# EAGLE design pxvi-001 (EAGLE 9.6.2)
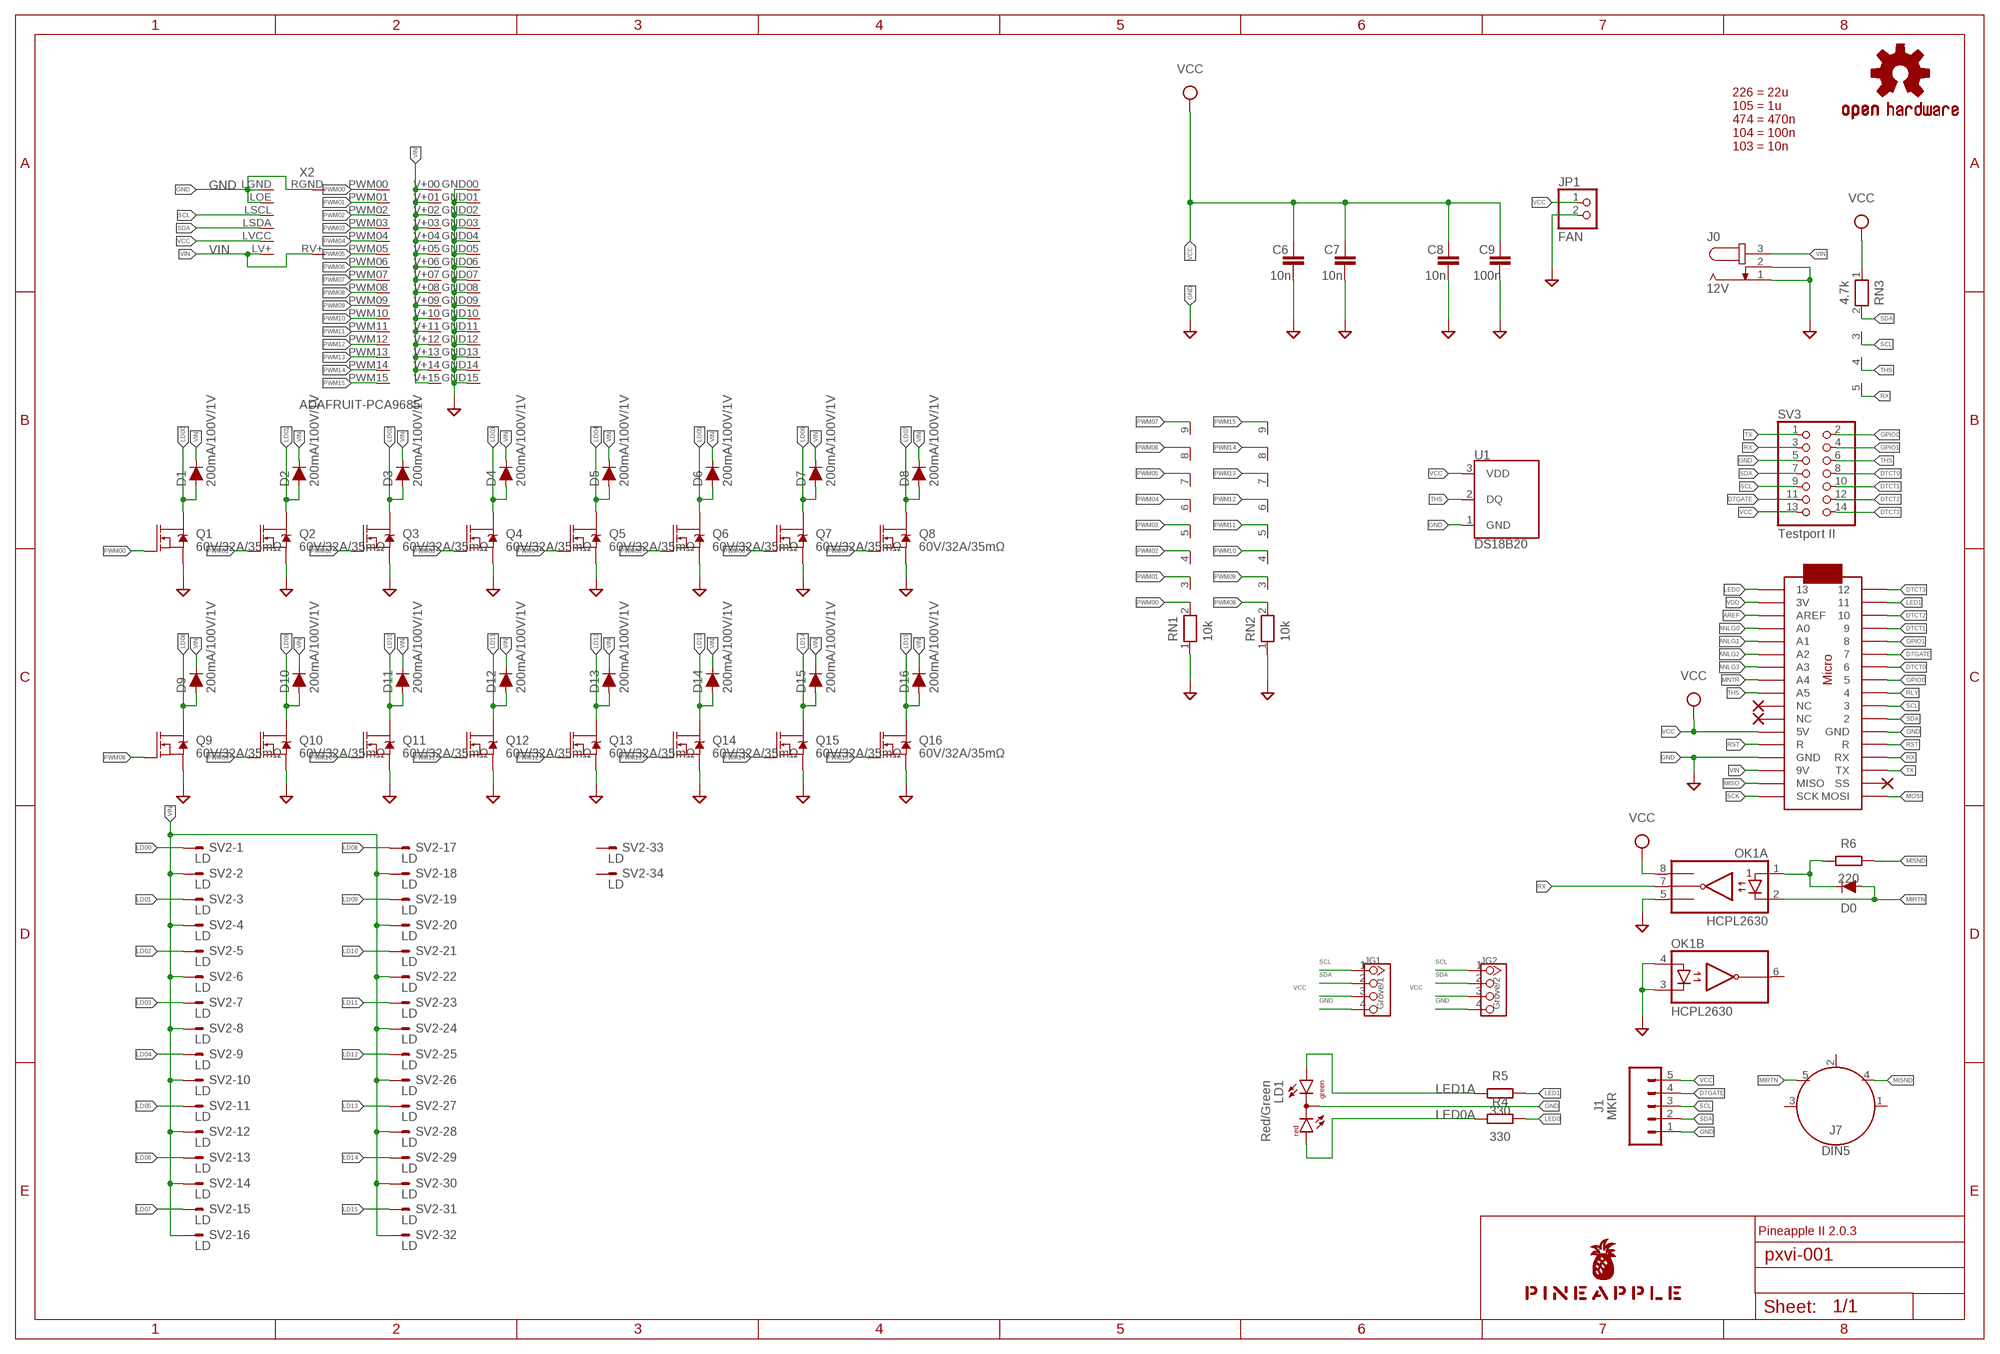
[diagram p0: schematic, sheet 1]

## Parts
C6  10n  C-EU025-024X044  [C025-024X044]
C7  10n  C-EU025-024X044  [C025-024X044]
C8  10n  C-EU025-024X044  [C025-024X044]
C9  100n  C-EU025-024X044  [C025-024X044]
D0  DIODE-1N4148  [DIODE-1N4148]
D1  200mA/100V/1V  DIODE-1N4148  [DIODE-1N4148]
D2  200mA/100V/1V  DIODE-1N4148  [DIODE-1N4148]
D3  200mA/100V/1V  DIODE-1N4148  [DIODE-1N4148]
D4  200mA/100V/1V  DIODE-1N4148  [DIODE-1N4148]
D5  200mA/100V/1V  DIODE-1N4148  [DIODE-1N4148]
D6  200mA/100V/1V  DIODE-1N4148  [DIODE-1N4148]
D7  200mA/100V/1V  DIODE-1N4148  [DIODE-1N4148]
D8  200mA/100V/1V  DIODE-1N4148  [DIODE-1N4148]
D9  200mA/100V/1V  DIODE-1N4148  [DIODE-1N4148]
D10  200mA/100V/1V  DIODE-1N4148  [DIODE-1N4148]
D11  200mA/100V/1V  DIODE-1N4148  [DIODE-1N4148]
D12  200mA/100V/1V  DIODE-1N4148  [DIODE-1N4148]
D13  200mA/100V/1V  DIODE-1N4148  [DIODE-1N4148]
D14  200mA/100V/1V  DIODE-1N4148  [DIODE-1N4148]
D15  200mA/100V/1V  DIODE-1N4148  [DIODE-1N4148]
D16  200mA/100V/1V  DIODE-1N4148  [DIODE-1N4148]
J0  12V  JACK-PLUG0  [SPC4077]
J1  MKR  CONN_05JST  [JST-5-PTH]
J7  DIN5  [DIN5-RA-PTH]
JG1  Grove/1  TWIG-4P-2.0'90D'  [4P-2.0-90D]
JG2  Grove/2  TWIG-4P-2.0'90D'  [4P-2.0-90D]
JP1  FAN  PINHD-1X2  [1X02]
LD1  Red/Green  DUOLED-RG-C  [DUOLED-C-5MM]
LOGO1  OSHW-LOGOS-COPPER  [OSHW-LOGO-S_COPPER]
MC1  ARDUINOMICRO  [ARDUINOMICRO]
OK1  HCPL2630  [DIL08]
Q1  60V/32A/35mΩ  MOSFET-NCH-FQP30N06L  [TO220V]
Q2  60V/32A/35mΩ  MOSFET-NCH-FQP30N06L  [TO220V]
Q3  60V/32A/35mΩ  MOSFET-NCH-FQP30N06L  [TO220V]
Q4  60V/32A/35mΩ  MOSFET-NCH-FQP30N06L  [TO220V]
Q5  60V/32A/35mΩ  MOSFET-NCH-FQP30N06L  [TO220V]
Q6  60V/32A/35mΩ  MOSFET-NCH-FQP30N06L  [TO220V]
Q7  60V/32A/35mΩ  MOSFET-NCH-FQP30N06L  [TO220V]
Q8  60V/32A/35mΩ  MOSFET-NCH-FQP30N06L  [TO220V]
Q9  60V/32A/35mΩ  MOSFET-NCH-FQP30N06L  [TO220V]
Q10  60V/32A/35mΩ  MOSFET-NCH-FQP30N06L  [TO220V]
Q11  60V/32A/35mΩ  MOSFET-NCH-FQP30N06L  [TO220V]
Q12  60V/32A/35mΩ  MOSFET-NCH-FQP30N06L  [TO220V]
Q13  60V/32A/35mΩ  MOSFET-NCH-FQP30N06L  [TO220V]
Q14  60V/32A/35mΩ  MOSFET-NCH-FQP30N06L  [TO220V]
Q15  60V/32A/35mΩ  MOSFET-NCH-FQP30N06L  [TO220V]
Q16  60V/32A/35mΩ  MOSFET-NCH-FQP30N06L  [TO220V]
R4  330  R-EU_0204/5  [0204/5]
R5  330  R-EU_0204/5  [0204/5]
R6  220  R-EU_0204/5  [0204/5]
RN1  10k  RN08  [RN-9]
RN2  10k  RN08  [RN-9]
RN3  4.7k  RN04  [RN-5]
SV2  LD  ML34LE  [ML34L]
SV3  Testport II  PINHD-2X7  [2X07]
U1  DS18B20  [TO-92-AMMO]
U$1  PINEAPPLE450_SILK  [PINEAPPLE450_SILK]
X2  ADAFRUIT-PCA9685  [ADAFRUIT-PCA9685-FOOTPRINT]

## Nets
ANLG0 [analog]: MC1.P$31(A0)
ANLG1 [analog]: MC1.P$30(A1)
ANLG2 [analog]: MC1.P$29(A2)
ANLG3 [analog]: MC1.P$28(A3)
AREF: MC1.P$32(AREF)
D7GATE: J1.4 MC1.P$6 SV3.11
DTCT0: MC1.P$7 SV3.8
DTCT1: MC1.P$4 SV3.10
DTCT2: MC1.P$3 SV3.12
DTCT3: MC1.P$1 SV3.14
GND [gnd]: C6.2 C7.2 C8.2 C9.2 J0.1 J0.2 J1.1 JG1.4 JG2.4 JP1.2 LD1.C MC1.P$12(GND) MC1.P$21(GND) OK1.3(B:C2) OK1.4(B:A2) OK1.5(A:GND) Q1.3(S) Q2.3(S) Q3.3(S) Q4.3(S) Q5.3(S) Q6.3(S) Q7.3(S) Q8.3(S) Q9.3(S) Q10.3(S) Q11.3(S) Q12.3(S) Q13.3(S) Q14.3(S) Q15.3(S) Q16.3(S) RN1.1 RN2.1 SV3.5 U1.1(GND) X2.GND00 X2.GND01 X2.GND02 X2.GND03 X2.GND04 X2.GND05 X2.GND06 X2.GND07 X2.GND08 X2.GND09 X2.GND10 X2.GND11 X2.GND12 X2.GND13 X2.GND14 X2.GND15 X2.LGND X2.LOE X2.RGND
GPIO0: MC1.P$8 SV3.2
GPIO1: MC1.P$5 SV3.4
LD00 [power]: D1.A Q1.2(D) SV2.1
LD01 [power]: D2.A Q2.2(D) SV2.3
LD02 [power]: D3.A Q3.2(D) SV2.5
LD03 [power]: D4.A Q4.2(D) SV2.7
LD04 [power]: D5.A Q5.2(D) SV2.9
LD05 [power]: D6.A Q6.2(D) SV2.11
LD06 [power]: D7.A Q7.2(D) SV2.13
LD07 [power]: D8.A Q8.2(D) SV2.15
LD08 [power]: D9.A Q9.2(D) SV2.17
LD09 [power]: D10.A Q10.2(D) SV2.19
LD10 [power]: D11.A Q11.2(D) SV2.21
LD11 [power]: D12.A Q12.2(D) SV2.23
LD12 [power]: D13.A Q13.2(D) SV2.25
LD13 [power]: D14.A Q14.2(D) SV2.27
LD14 [power]: D15.A Q15.2(D) SV2.29
LD15 [power]: D16.A Q16.2(D) SV2.31
LED0: MC1.P$34 R4.2
LED0A: LD1.AR R4.1
LED1: MC1.P$2 R5.2
LED1A: LD1.AX(AG) R5.1
MIDIINSND: D0.C OK1.1(A:A1) R6.1
MIRTN: D0.A J7.5 OK1.2(A:C1)
MISND: J7.4 R6.2
MISO: MC1.P$19(MISO)
MNTR: MC1.P$27(A4)
MOSI: MC1.P$17(MOSI)
PWM00: Q1.1(G) RN1.2 X2.PWM00
PWM01: Q2.1(G) RN1.3 X2.PWM01
PWM02: Q3.1(G) RN1.4 X2.PWM02
PWM03: Q4.1(G) RN1.5 X2.PWM03
PWM04: Q5.1(G) RN1.6 X2.PWM04
PWM05: Q6.1(G) RN1.7 X2.PWM05
PWM06: Q7.1(G) RN1.8 X2.PWM06
PWM07: Q8.1(G) RN1.9 X2.PWM07
PWM08: Q9.1(G) RN2.2 X2.PWM08
PWM09: Q10.1(G) RN2.3 X2.PWM09
PWM10: Q11.1(G) RN2.4 X2.PWM10
PWM11: Q12.1(G) RN2.5 X2.PWM11
PWM12: Q13.1(G) RN2.6 X2.PWM12
PWM13: Q14.1(G) RN2.7 X2.PWM13
PWM14: Q15.1(G) RN2.8 X2.PWM14
PWM15: Q16.1(G) RN2.9 X2.PWM15
RLY: MC1.P$9
RST: MC1.P$13(R) MC1.P$22(R)
RX: MC1.P$14(RX) OK1.7(A:VO1) RN3.5 SV3.3
SCK: MC1.P$18(SCK)
SCL: J1.3 JG1.1 JG2.1 MC1.P$10 RN3.3 SV3.9 X2.LSCL
SDA: J1.2 JG1.2 JG2.2 MC1.P$11 RN3.2 SV3.7 X2.LSDA
THS: MC1.P$26(A5) RN3.4 SV3.6 U1.2(DQ)
TX: MC1.P$15(TX) SV3.1
VCC [power]: C6.1 C7.1 C8.1 C9.1 J1.5 JG1.3 JG2.3 JP1.1 MC1.P$23(5V) OK1.8(A:VCC) RN3.1 SV3.13 U1.3(VDD) X2.LVCC
VDD [power]: MC1.P$33(3V)
VIN [superpower]: D1.C D2.C D3.C D4.C D5.C D6.C D7.C D8.C D9.C D10.C D11.C D12.C D13.C D14.C D15.C D16.C J0.3 MC1.P$20(9V) SV2.2 SV2.4 SV2.6 SV2.8 SV2.10 SV2.12 SV2.14 SV2.16 SV2.18 SV2.20 SV2.22 SV2.24 SV2.26 SV2.28 SV2.30 SV2.32 X2.LV+ X2.RV+ X2.V+00 X2.V+01 X2.V+02 X2.V+03 X2.V+04 X2.V+05 X2.V+06 X2.V+07 X2.V+08 X2.V+09 X2.V+10 X2.V+11 X2.V+12 X2.V+13 X2.V+14 X2.V+15
Unconnected: J7.1 J7.2 J7.3 MC1.P$16(SS) MC1.P$24(NC) MC1.P$25(NC) OK1.6(B:VO2) SV2.33 SV2.34

## Notes on the sheet
- 226 = 22u
  105 = 1u
  474 = 470n
  104 = 100n
  103 = 10n
- Pineapple II 2.0.3

## Library data of the parts
C6-C9 = resistor:C-EU: CAPACITOR, European symbol
D0 = SparkFun-DiscreteSemi:DIODE: Diode These are standard reverse protection diodes and small signal diodes. SparkFun Products: SparkFun SparkPunk Sound Kit <https://www.sparkfun.com/products/11177> SparkFun ESP8266 Thing <https://www.sparkfun.com/products/13231>; PROD_ID: DIO-08378; VALUE: 200mA/100V/1V
D1-D16 = SparkFun-DiscreteSemi:DIODE: Diode These are standard reverse protection diodes and small signal diodes. SparkFun Products: SparkFun SparkPunk Sound Kit <https://www.sparkfun.com/products/11177> SparkFun ESP8266 Thing <https://www.sparkfun.com/products/13231>; PROD_ID: DIO-08378
J0 = con-jack:JACK-PLUG: DC POWER JACK Power Jack, DC, Right Angle, Through Hole, Rated 5A at 16VDC, PC Terminals Distributor: Farnell (www.Farnell.de) Drawing: 84N1161.pdf / 84N1162.pdf Manufacturer: SPC Technology (www.spctechnology.com) Type: SPC4077 / SPC 4078; OC_FARNELL: unknown; OC_NEWARK: unknown
J1 = SparkFun-Connectors:CONN_05: Multi connection point. Often used as Generic Header-pin footprint for 0.1 inch spaced/style header connections On any of the 0.1 inch spaced packages, you can populate with these: Break Away Headers - Straight <https://www.sparkfun.com/products/116> (PRT-00116) Break Away Male Headers - Right Angle <https://www.sparkfun.com/products/553> (PRT-00553) Female Headers <https://www.sparkfun.com/products/115> (PRT-00115) Break Away Headers - Machine Pin <https://www.sparkfun.com/products/117> (PRT-00117) Break Away Female Headers - Swiss Machine Pin <https://www.sparkfun.com/products/743> (PRT-00743) For SCREWTERMINALS and SPRING TERMINALS visit here: Screw Terimnals on SparkFun.com <https://www.sparkfun.com/search/results?term=Screw+Terminals> (5mm/3.5mm/2.54mm spacing) This device is also useful as a general connection point to wire up your design to another part of your project. Our various solder wires solder well into these plated through hole pads. Hook-Up Wire - Assortment (Stranded, 22 AWG) <https://www.sparkfun.com/products/11375> (PRT-11375) Hook-Up Wire - Assortment (Solid Core, 22 AWG) <https://www.sparkfun.com/products/11367> (PRT-11367) View the entire wire category on our website here <https://www.sparkfun.com/categories/141> Special notes: Molex polarized connector foot print use with SKU : PRT-08231 with associated crimp pins and housings. 1MM SMD Version SKU: PRT-10208; SF_ID: PRT-09917
J7 = SparkFun-Connectors:DIN5: DIN5 Connector - Female Right Angle (frequently used as a MIDI Jack connector) This type of connector and cable is frequently used for transmitting midi data (musical instrument digital interface). It is what you usually see on a keyboard or set of electronic drums. Learn more here <https://en.wikipedia.org/wiki/MIDI>. For more information on the pinout and electrical specifications of MIDI communications, please see the following resource: https://www.midi.org/specifications/item/midi-din-electrical-specification Here is the connector we sell at SparkFun: MIDI Connector - Female Right Angle <https://www.sparkfun.com/products/9536> (PRT-09536) Datasheet <hhttp://www.sparkfun.com/datasheets/Prototyping/Connectors/MIDI-RA.pdf> It is used on this SparkFun product: SparkFun MIDI Shield <https://www.sparkfun.com/products/12898> (DEV-12898); PROD_ID: CONN-09481
JG1 JG2 = Connector:TWIG-4P-2.0
JP1 = pinhead:PINHD-1X2: PIN HEADER
LD1 = led:DUOLED-RG-C: DUO LED 2 colors (red/green), 5 mm, round, common Cathode www.ligitek.com or other producers.
LOGO1 = SparkFun-Aesthetics:OSHW-LOGO: Open-Source Hardware (OSHW) Logo This logo indicates the piece of hardware it is found on incorporates a OSHW license and/or adheres to the definition of open source hardware found here: http://freedomdefined.org/OSHW
MC1 = adafruit:ARDUINOMICRO
OK1 = optocoupler:HCPL2630: HEWLETT PACKARD OPTO COUPLER; MF: AGILENT TECHNOLOGIES; MPN: HCPL-2630-000E; OC_FARNELL: 9994904; OC_NEWARK: 88H7813
Q1-Q16 = SparkFun-DiscreteSemi:MOSFET-NCH: N-channel MOSFETs Voltage controlled devices that allow control of high current outputs. SparkFun Products: SparkFun OpenScale <https://www.sparkfun.com/products/13261> SparkFun Digital Sandbox <https://www.sparkfun.com/products/12651> SparkFun Monster Moto Shield <https://www.sparkfun.com/products/10182> SparkFun MOSFET Power Controller <https://www.sparkfun.com/products/11214>; PROD_ID: TRANS-10060
R4-R6 = resistor:R-EU_: RESISTOR, European symbol
RN1 RN2 = resistor-net:RN08: RESISTOR NETWORK; OC_FARNELL: unknown; OC_NEWARK: unknown
RN3 = resistor-net:RN04: RESISTOR NETWORK; OC_FARNELL: unknown; OC_NEWARK: unknown
SV2 = con-ml:ML34LE: HARTING; OC_FARNELL: unknown; OC_NEWARK: unknown
SV3 = pinhead:PINHD-2X7: PIN HEADER
U1 = SparkFun-Sensors:DS18B20: Dallas/Maxim DS18B20 1-Wire Temperature Sensor The DS18B20 reports degrees C with 9 to 12-bit precision, -55C to 125C (+/-0.5C). Each sensor has a unique 64-Bit Serial number etched into it - allows for a huge number of sensors to be used on one data bus. Datasheet <http://datasheets.maximintegrated.com/en/ds/DS18B20.pdf> SparkFun Products One Wire Digital Temperature Sensor - DS18B20 <https://www.sparkfun.com/products/245> (SEN-00245); STORE_ID: SEN-00245
U$1 = pineapple:PINEAPPLE450_SILK
X2 = adafruit-pca9685:ADAFRUIT-PCA9685: AQM0802A-RN-GBW LCD

## Net classes
0 default: width 0.152 mm, drill 0.152 mm, clearance 0.152 mm
1 gnd: width 0.305 mm, drill 0.152 mm, clearance 0.152 mm
2 power: width 0.508 mm, drill 0.152 mm, clearance 0.152 mm
3 analog: width 0.305 mm, drill 0.152 mm, clearance 0.152 mm
4 superpower: width 1.016 mm, drill 0.152 mm, clearance 0.152 mm

## Board
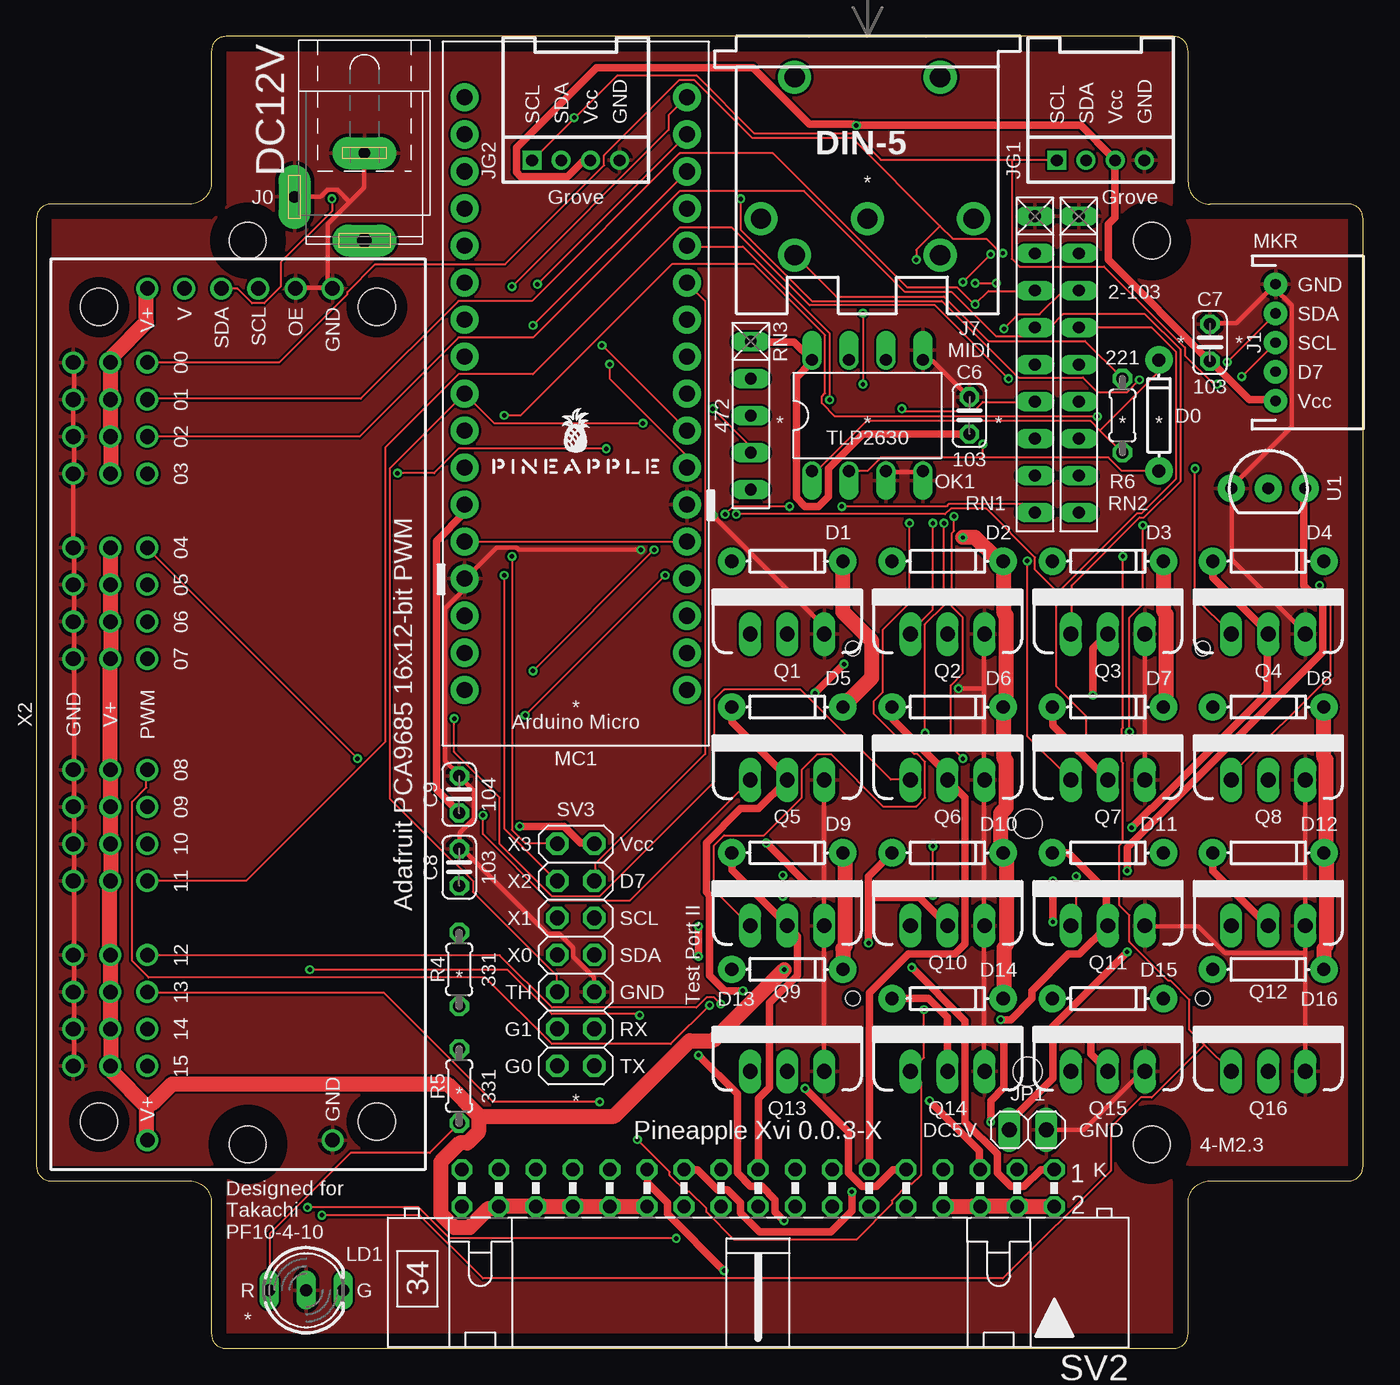
[diagram p1: board, top side]
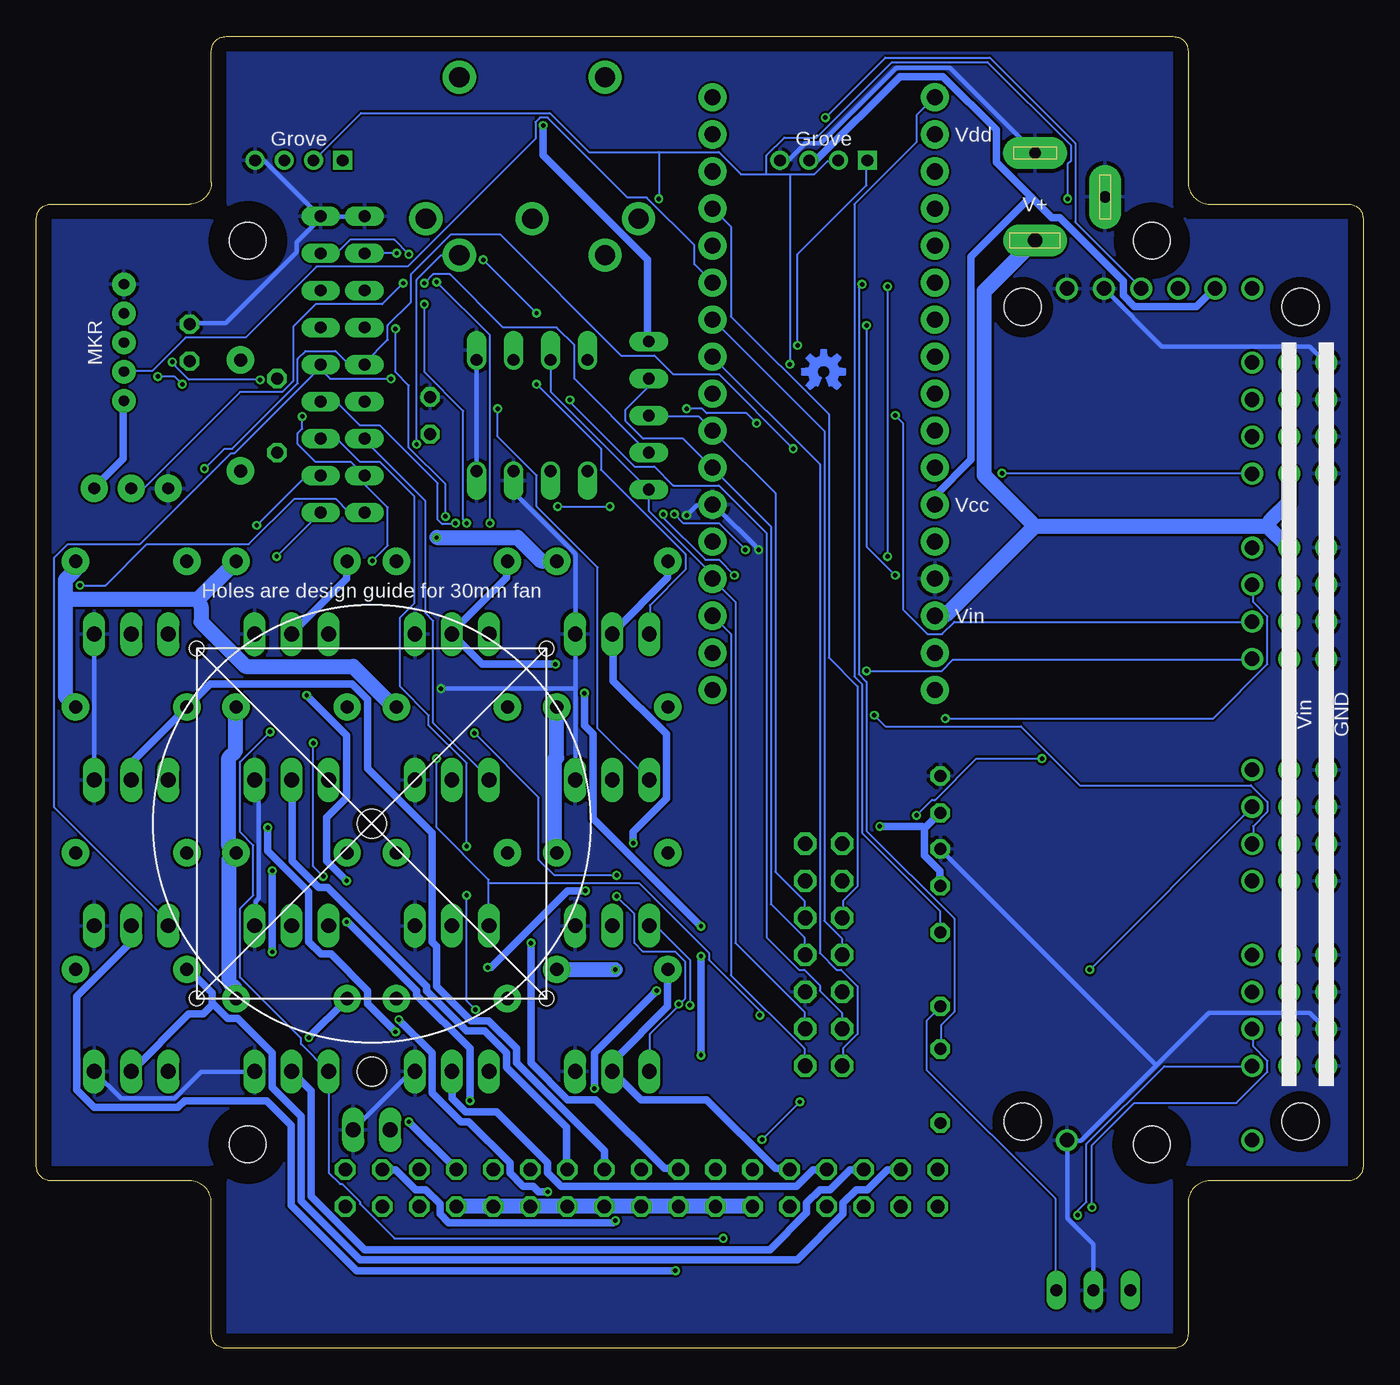
[diagram p2: board, bottom side, seen from below]

Size 91 x 90 mm. Coordinates in mm from the lower left corner, seen from the top.
Outline: 78,90 13,90 arc90 12,89 12,80 arc-90 10.5,78.5 1,78.5 arc90 0,77.5 0,12.5 arc90 1,11.5 10.5,11.5 arc-90 12,10 12,1 arc90 13,0 78,0 arc90 79,1 79,10 arc-90 80.5,11.5 90,11.5 arc90 91,12.5 91,77.5 arc90 90,78.5 80.5,78.5 arc-90 79,80 79,89 arc90 78,90
Copper layers (1*16): Top 0.035mm / dielectric 1.5mm / Bottom 0.035mm
Design rules "SeeedStudio_2layer_DRU_no_angle_20140221": minimum track width 6mil, minimum drill 12mil, track to track 6mil, track to pad 6mil, pad to pad 6mil, via to via 6mil, smd to smd 0mil, copper to edge 10mil, drill to drill 10mil, minimum pad ring 10mil, minimum via ring 6mil, stop-mask expansion 2mil, vias tented up to drill 100mil, thermal gap 10mil
Holes 2.5 mm at 76.5,76 14.5,76 76.5,14 14.5,14
Holes 2 mm at 68,36 68,19
Holes 1 mm at 56,48 80,48 56,24 80,24
tRestrict: area 12,73.5 to 17,78.5; area 73.9,73.4 to 79.1,78.6; area 73.9,11.4 to 79.1,16.6; area 12,89 to 79,90; area 90,11.5 to 91,78.5; area 12,0 to 79,1; area 0,11.5 to 1,78.5; area 0,77.5 to 12,78.5; area 12,78.5 to 13,90; area 78,78.5 to 79,90; area 79,77.5 to 91,78.5; area 79,11.5 to 91,12.5; 14 more areas
bRestrict: area 11.9,11.4 to 17.1,16.6; area 73.9,11.4 to 79.1,16.6; area 73.9,73.4 to 79.1,78.6; area 12,73.5 to 17,78.5; area 78,0 to 79,11.5; area 79,11.5 to 91,12.5; area 90,11.5 to 91,78.5; area 79,77.5 to 91,78.5; area 78,78.5 to 79,90; area 12,89 to 79,90; area 12,78.5 to 13,90; area 0,77.5 to 12,78.5; 14 more areas

### Footprints (pad centres in the part's own frame; a part is rotated, then mirrored left to right if it is on the bottom)
C025-024X044 = drill 0.813 octagon: 1 -1.27,0; 2 1.27,0
DIODE-1N4148 = drill 0.9 pad 1.88: A -3.81,0; C 3.81,0
SPC4077 = drill 0.8 pad 2.184 long: 1 -3,0; 2 0,-4.8 | drill 1 pad 2.184 long: 3 3,0
JST-5-PTH = drill 0.7 pad 1.6: 1 -4,0; 2 -2,0; 3 0,0; 4 2,0; 5 4,0
DIN5-RA-PTH = drill 1.4 pad 2.286: 1 7.3,12.5; 2 0,12.5; 3 -7.3,12.5; 4 5,15; 5 -5,15; 6 -5,2.8; 7 5,2.8
4P-2.0-90D = drill 0.8 pad 1.27 square: 1 -3,0 | drill 0.8 pad 1.27: 2 -1,0; 3 1,0; 4 3,0
1X02 = drill 1.016 long: 1 -1.27,0; 2 1.27,0
DUOLED-C-5MM = drill 0.813 long: AR 2.54,0; AX -2.54,0; C 0,0
ARDUINOMICRO = drill 1.1 pad 1.93: P$1 -20.32,7.62; P$2 -17.78,7.62; P$3 -15.24,7.62; P$4 -12.7,7.62; P$5 -10.16,7.62; P$6 -7.62,7.62; P$7 -5.08,7.62; P$8 -2.54,7.62; P$9 0,7.62; P$10 2.54,7.62; P$11 5.08,7.62; P$12 12.7,-7.62; P$13 10.16,-7.62; P$14 12.7,7.62; P$15 15.24,7.62; P$16 17.78,7.62; P$17 20.32,7.62; P$18 20.32,-7.62; P$19 17.78,-7.62; P$20 15.24,-7.62; P$21 7.62,7.62; P$22 10.16,7.62; P$23 7.62,-7.62; P$24 5.08,-7.62; P$25 2.54,-7.62; P$26 0,-7.62; P$27 -2.54,-7.62; P$28 -5.08,-7.62; P$29 -7.62,-7.62; P$30 -10.16,-7.62; P$31 -12.7,-7.62; P$32 -15.24,-7.62; P$33 -17.78,-7.62; P$34 -20.32,-7.62
DIL08 = drill 0.813 offset: 1 -3.81,-3.81; 2 -1.27,-3.81; 3 1.27,-3.81; 4 3.81,-3.81; 5 3.81,3.81; 6 1.27,3.81; 7 -1.27,3.81; 8 -3.81,3.81
TO220V = drill 1.016 long: 1 -2.54,0; 2 0,0; 3 2.54,0
0204/5 = drill 0.813 octagon: 1 -2.54,0; 2 2.54,0
RN-9 = drill 0.813 long: 1 -10.16,0; 2 -7.62,0; 3 -5.08,0; 4 -2.54,0; 5 0,0; 6 2.54,0; 7 5.08,0; 8 7.62,0; 9 10.16,0
RN-5 = drill 0.813 long: 1 -5.08,0; 2 -2.54,0; 3 0,0; 4 2.54,0; 5 5.08,0
ML34L = drill 0.914 octagon: 1 -20.32,-1.27; 2 -20.32,1.27; 3 -17.78,-1.27; 4 -17.78,1.27; 5 -15.24,-1.27; 6 -15.24,1.27; 7 -12.7,-1.27; 8 -12.7,1.27; 9 -10.16,-1.27; 10 -10.16,1.27; 11 -7.62,-1.27; 12 -7.62,1.27; 13 -5.08,-1.27; 14 -5.08,1.27; 15 -2.54,-1.27; 16 -2.54,1.27; 17 0,-1.27; 18 0,1.27; 19 2.54,-1.27; 20 2.54,1.27; 21 5.08,-1.27; 22 5.08,1.27; 23 7.62,-1.27; 24 7.62,1.27; 25 10.16,-1.27; 26 10.16,1.27; 27 12.7,-1.27; 28 12.7,1.27; 29 15.24,-1.27; 30 15.24,1.27; 31 17.78,-1.27; 32 17.78,1.27; 33 20.32,-1.27; 34 20.32,1.27
2X07 = drill 1.016 octagon: 1 -7.62,-1.27; 2 -7.62,1.27; 3 -5.08,-1.27; 4 -5.08,1.27; 5 -2.54,-1.27; 6 -2.54,1.27; 7 0,-1.27; 8 0,1.27; 9 2.54,-1.27; 10 2.54,1.27; 11 5.08,-1.27; 12 5.08,1.27; 13 7.62,-1.27; 14 7.62,1.27
TO-92-AMMO = drill 0.813 pad 1.88: 1 -2.54,0; 2 0,0; 3 2.54,0
ADAFRUIT-PCA9685-FOOTPRINT = drill 1: GND00 -24.13,1.524; GND01 -21.59,1.524; GND02 -19.05,1.524; GND03 -16.51,1.524; GND04 -11.43,1.524; GND05 -8.89,1.524; GND06 -6.35,1.524; GND07 -3.81,1.524; GND08 3.81,1.524; GND09 6.35,1.524; GND10 8.89,1.524; GND11 11.43,1.524; GND12 16.51,1.524; GND13 19.05,1.524; GND14 21.59,1.524; GND15 24.13,1.524; LGND -29.21,19.304; LOE -29.21,16.764; LSCL -29.21,14.224; LSDA -29.21,11.684; LV+ -29.21,6.604; LVCC -29.21,9.144; PWM00 -24.13,6.604; PWM01 -21.59,6.604; PWM02 -19.05,6.604; PWM03 -16.51,6.604; PWM04 -11.43,6.604; PWM05 -8.89,6.604; PWM06 -6.35,6.604; PWM07 -3.81,6.604; PWM08 3.81,6.604; PWM09 6.35,6.604; PWM10 8.89,6.604; PWM11 11.43,6.604; PWM12 16.51,6.604; PWM13 19.05,6.604; PWM14 21.59,6.604; PWM15 24.13,6.604; RGND 29.21,19.304; RV+ 29.21,6.604; V+00 -24.13,4.064; V+01 -21.59,4.064; V+02 -19.05,4.064; V+03 -16.51,4.064; V+04 -11.43,4.064; V+05 -8.89,4.064; V+06 -6.35,4.064; V+07 -3.81,4.064; V+08 3.81,4.064; V+09 6.35,4.064; V+10 8.89,4.064; V+11 11.43,4.064; V+12 16.51,4.064; V+13 19.05,4.064; V+14 21.59,4.064; V+15 24.13,4.064 | hole 2.54: -27.94,3.302; 27.94,3.302; -27.94,22.352; 27.94,22.352

### Placement (x,y rotation side)
C6  64,64 90 top
C7  80.5,69 90 top
C8  29,33 90 top
C9  29,38 90 top
D0  77,64 90 top
D1  51.5,54 0 top
D2  62.5,54 0 top
D3  73.5,54 0 top
D4  84.5,54 0 top
D5  51.5,44 0 top
D6  62.5,44 0 top
D7  73.5,44 0 top
D8  84.5,44 0 top
D9  51.5,34 0 top
D10  62.5,34 0 top
D11  73.5,34 0 top
D12  84.5,34 0 top
D13  51.5,26 0 top
D14  62.5,24 0 top
D15  73.5,24 0 top
D16  84.5,26 0 top
J0  22.5,79 270 top
J1  85,69 270 top
J7  57,90 180 top
JG1  73,81.5 0 top
JG2  37,81.5 0 top
JP1  68,15 0 top
LD1  18.5,4 0 top
LOGO1  37,67 0 bottom
MC1  37,65.5 270 top
OK1  57,64 0 top
Q1  51.5,49 0 top
Q2  62.5,49 0 top
Q3  73.5,49 0 top
Q4  84.5,49 0 top
Q5  51.5,39 0 top
Q6  62.5,39 0 top
Q7  73.5,39 0 top
Q8  84.5,39 0 top
Q9  51.5,29 0 top
Q10  62.5,29 0 top
Q11  73.5,29 0 top
Q12  84.5,29 0 top
Q13  51.5,19 0 top
Q14  62.5,19 0 top
Q15  73.5,19 0 top
Q16  84.5,19 0 top
R4  29,26 90 top
R5  29,18 90 top
R6  74.5,64 90 top
RN1  68.5,67.5 270 top
RN2  71.5,67.5 270 top
RN3  49,64 270 top
SV2  49.5,11 180 top
SV3  37,27 90 top
U1  84.5,59 0 top
U$1  37,60 0 top
X2  1,43.5 270 top

### Tracks (layer width: path | path; a pad name or v marks a point on that pad's centre or on a via)
D7GATE
  Top 0.152: SV3.11 38.33,32.08 38.33,33.22 45.87,40.77 45.87,71.86 44.65,73.08 MC1.P$6
  Bottom 0.152: J1.4 84.96,67.06 83.06,67.06 80.77,69.34 76.66,69.34 71.78,74.22 65.53,74.22 56.77,82.98 56.77,84.12 56.46,84.43 55.93,84.43 50.44,78.94 49.15,78.94 45.87,75.67 45.87,74.37 44.65,73.15 MC1.P$6
DTCT0
  Bottom 0.152: SV3.8 35.74,27.05 35.74,28.12 36.96,29.34 36.96,62.94 44.58,70.56 MC1.P$7
DTCT1
  Bottom 0.152: SV3.10 35.66,29.57 35.66,30.71 34.67,31.7 34.67,45.41 36.65,47.4 36.65,64.08 43.36,70.79 43.36,76.96 44.58,78.18 MC1.P$4
DTCT2  (via drill 0.3)
  Top 0.152: v32.08,53.03 32.08,35.66 35.66,32.08 SV3.12 | v34.06,70.18 44.58,80.7 MC1.P$3
  Bottom 0.152: v32.08,53.03 34.06,55.02 v34.06,70.18
DTCT3  (via drill 0.3)
  Top 0.152: v32.61,54.33 32.61,35.59 33.53,34.67 35.66,34.67 SV3.14 | v32.61,72.85 43.36,83.59 43.36,84.58 44.58,85.8 MC1.P$1
  Bottom 0.152: v32.61,72.85 v32.61,54.33
GND  (via drill 0.3)
  Top 0.305: OK1.3 58.29,60.12 60.81,60.12 OK1.4 | OK1.5 60.88,67.74 61.49,67.74 63.93,65.3 C6.2 | Q13.3 54.03,19.05 54.03,28.96 Q9.3 54.03,29.11 54.03,38.94 Q5.3 | v46.41,57.15 54.03,49.53 54.03,49.07 Q1.3 | Q15.3 75.97,18.97 75.82,18.97 71.86,15.01 69.34,15.01 JP1.2 | 65,45.26 65,39.09 Q6.3 65,38.94 65,29.03 Q10.3 65,28.88 65,19.05 Q14.3 | 65,45.26 65,49 Q2.3 | C7.2 80.54,70.33 82.3,70.33 84.96,73 J1.1 84.89,72.77 86.11,71.55 86.11,63.25 81.99,59.13 U1.1 81.99,58.98 81.99,54.1 87.02,49.07 Q4.3 | Q3.3 76.05,39.01 Q7.3 | 87.02,27.13 87.02,28.96 Q12.3 87.02,29.11 87.02,38.94 Q8.3 | 87.02,27.13 87.02,19.05 Q16.3 | 87.02,27.13 81.53,27.13 79.7,28.96 76.05,28.96 Q11.3 | 65,45.26 v63.25,45.26 | SV3.5 38.25,24.46 38.25,25.45 36.8,26.9 36.8,27.51 35.89,28.42 35.05,28.42 29.18,34.29 C8.2 29.03,34.29 29.03,35.36 30.02,36.35 30.02,38.25 29.03,39.24 C9.2 28.96,39.4 28.04,40.31 28.04,50.75 29.34,52.05 29.34,52.73 MC1.P$12 29.49,52.88 31.55,54.94 32.92,54.94 33.07,54.79 v41.45,54.79 | X2.LOE 17.83,72.77 20.27,72.77 X2.LGND 19.96,72.85 19.96,77.11 21.49,78.64 | 21.49,78.64 22.48,79.63 22.48,81.99 J0.1 | 21.49,78.64 20.65,79.48 19.96,79.48 19.51,79.02 17.75,79.02 J0.2 | X2.GND00 2.59,67.59 2.59,65.15 X2.GND01 2.52,65 2.52,62.64 X2.GND02 2.59,62.48 2.59,60.05 X2.GND03 2.52,59.89 2.52,55.02 X2.GND04 2.59,54.86 2.59,52.5 X2.GND05 2.59,52.35 2.59,49.99 X2.GND06 2.59,49.84 2.59,47.32 X2.GND07 2.59,47.17 2.59,39.78 X2.GND08 2.59,39.62 2.59,37.26 X2.GND09 2.59,37.11 2.59,34.75 X2.GND10 2.59,34.59 2.59,32.08 X2.GND11 2.59,31.93 2.59,27.13 X2.GND12 2.59,26.98 2.59,24.54 X2.GND13 2.59,24.38 2.59,22.02 X2.GND14 2.59,21.87 2.59,19.43 X2.GND15
  Bottom 0.305: OK1.4 60.81,67.74 OK1.5 | 54.03,45.26 54.03,39.01 Q5.3 | 54.03,45.26 54.03,49 Q1.3 54.03,49.15 54.03,54.48 58.22,58.67 58.22,60.12 OK1.3 | v46.41,57.15 45.72,57.84 44.65,57.84 MC1.P$21 44.5,57.84 v41.45,54.79 | Q14.3 65.08,18.97 65.3,18.97 JP1.2 | JG1.4 75.97,81.46 75.36,81.46 71.55,77.65 RN2.1 | RN1.1 68.5,77.65 71.4,77.65 RN2.1 | C7.2 80.47,70.33 78.03,70.33 73.15,75.21 73.15,75.89 71.55,77.5 RN2.1 | Q11.3 75.97,29.03 75.97,30.63 75.74,30.86 75.74,38.71 75.97,38.94 Q7.3 | Q4.3 87.02,49 87.02,39.01 Q8.3 | Q15.3 76.05,18.97 79.7,18.97 81.53,17.14 85.19,17.14 87.02,18.97 Q16.3 | v63.25,45.26 54.03,45.26 | JG2.4 39.93,81.53 39.4,81.53 38.25,82.68 37.19,82.68 32,87.86 28.35,87.86 22.55,82.07 J0.1 | LD1.C 18.52,4.04 18.52,7.16 20.27,8.91 20.27,14.25 X2.RGND 20.12,14.25 19.36,14.25 14.17,19.43 | 14.17,19.43 10.59,23.01 3.66,23.01 2.59,21.95 X2.GND14 | X2.LOE 17.75,72.69 13.79,68.73 3.66,68.73 2.59,67.67 X2.GND00 | 14.17,19.43 28.96,34.21 C8.2
  pour Top: -1,-1 92,-1 92,91 -1,91
  pour Bottom: -2,-2 93,-2 93,92 -2,92
GPIO0
  Bottom 0.152: SV3.2 35.66,19.43 35.66,20.57 34.67,21.57 34.67,24.84 35.81,25.98 36.12,25.98 37.26,27.13 37.26,60.66 44.58,67.97 MC1.P$8
GPIO1  (via drill 0.3)
  Top 0.152: v54.41,65.08 54.41,69.65 48.46,75.59 44.65,75.59 MC1.P$5
  Bottom 0.152: v54.41,65.08 54.41,64.92 49.99,60.5 48.62,60.5 47.32,59.21 44.2,59.21 40.92,55.93 40.92,28.19 38.71,25.98 38.33,25.98 37.26,24.92 37.26,24.54 35.74,23.01 35.74,21.95 SV3.4
LD00  (via drill 0.3)
  Top 0.508: v60.05,26.14 63.7,22.48 63.7,15.54 65.91,13.34 65.91,12.04 66.83,11.12 67.74,11.12 68.89,12.27 69.8,12.27 SV2.1 | v50.06,34.67 v53.34,31.39
  Bottom 0.508: v60.05,26.14 59.82,26.14 54.56,31.39 v53.34,31.39 | v50.06,34.67 50.06,35.43 47.78,37.72 47.78,42.14 51.44,45.8 51.44,49 Q1.2 51.36,49.23 47.7,52.88 47.7,53.95 D1.A
LD01  (via drill 0.3)
  Top 0.508: v51.28,8.76 50.67,9.37 50.67,10.21 49.76,11.12 49,11.12 48.08,12.04 48.08,17.45 v45.41,20.12 | v45.41,28.96 v45.41,26.9 | v55.4,46.94 v53.42,44.96
  Bottom 0.508: v51.28,8.76 51.44,8.61 62.71,8.61 63.32,9.22 63.32,9.91 64.31,10.9 65,10.9 66.37,12.27 67.21,12.27 SV2.3 | v45.41,26.9 v45.41,20.12 | v45.41,28.96 52.81,36.35 52.81,42.14 53.42,42.75 v53.42,44.96 | v55.4,46.94 60.43,46.94 62.48,49 Q2.2 62.41,49.23 58.75,52.88 58.75,53.95 D2.A
LD02  (via drill 0.3)
  Top 0.508: v61.27,16.99 64.69,13.56 64.69,12.34 SV2.5 | v69.72,32.08 v69.72,29.26 | v72.47,44.81 72.47,48.01 73.46,49 Q3.2
  Bottom 0.508: v61.27,16.99 61.27,20.57 64.92,24.23 64.92,24.54 69.65,29.26 v69.72,29.26 | v69.72,32.08 71.09,33.45 71.09,36.42 69.72,37.8 69.72,42.06 v72.47,44.81 | D3.A 69.72,53.95 69.72,52.81 73.46,49.07 Q3.2
LD03  (via drill 0.3)
  Top 0.508: v65.46,15.54 65.46,16.99 66.37,17.91 v66.37,21.72 | v75.13,35.74 76.43,37.03 76.5,37.03 84.43,44.96 84.43,49 Q4.2 84.35,49.23 80.7,52.88 80.7,53.95 D4.A
  Bottom 0.508: v65.46,15.54 62.26,12.34 SV2.7 | v66.37,21.72 68.28,23.62 68.28,24.54 70.79,27.05 71.48,27.05 72.31,27.89 72.31,31.32 75.13,34.14 v75.13,35.74
LD04  (via drill 0.3)
  Top 0.508: v52.73,17.83 55.7,14.86 55.7,12.04 56.62,11.12 57.61,11.12 58.75,12.27 59.59,12.27 SV2.9 | v48.46,24.54 47.24,24.54 46.18,25.6 46.18,31.09 45.95,31.32 45.95,34.67 48.31,37.03 49.53,37.03 51.44,38.94 Q5.2 51.44,39.24 47.7,42.98 47.7,43.97 D5.A
  Bottom 0.508: v52.73,17.83 52.73,20.27 v48.46,24.54
LD05
  Top 0.508: SV2.11 57.15,12.34 57.15,24.38 59.82,27.05 63.02,27.05 63.7,27.74 63.7,37.8 62.56,38.94 Q6.2 62.41,39.24 62.41,39.47 58.75,43.13 58.75,43.97 D6.A
LD06
  Top 0.508: D7.A 69.72,43.97 69.72,42.75 73.46,39.01 Q7.2
  Bottom 0.508: SV2.13 54.63,12.34 54.63,15.16 58.75,19.28 58.75,20.27 60.27,21.79 61.49,21.79 64.24,24.54 64.24,24.84 71.02,31.62 71.63,31.62 73.46,33.45 73.46,38.94 Q7.2
LD07
  Bottom 0.508: SV2.15 52.05,12.34 52.05,13.56 58.06,19.58 58.06,20.57 59.97,22.48 61.19,22.48 63.55,24.84 63.55,27.58 63.86,27.89 63.86,35.36 68.28,39.78 68.28,44.5 69.34,45.57 79.1,45.57 80.62,44.04 D8.A 80.85,43.81 84.43,40.23 84.43,39.01 Q8.2
LD08
  Top 0.508: SV2.17 49.53,12.34 49.53,17.14 50.29,17.91 50.29,23.7 52.2,25.6 52.2,28.27 51.51,28.96 Q9.2 51.36,29.18 47.7,32.84 47.7,33.98 D9.A
LD09  (via drill 0.3)
  Top 0.508: 57.07,30.94 57.07,32.38 58.67,33.98 D10.A | 57.07,30.94 v57.07,27.81 | 57.07,30.94 60.58,30.94 62.48,29.03 Q10.2
  Bottom 0.508: v57.07,27.81 57.07,19.58 54.56,17.07 52.65,17.07 47.93,12.34 47.02,12.34 SV2.19
LD10  (via drill 0.3)
  Top 0.508: v55.93,10.74 55.93,9.45 54.48,8 49.61,8 48.31,9.3 48.31,9.98 47.4,10.9 46.71,10.9 45.34,12.27 SV2.21 | v66.14,22.55 66.83,22.55 68.28,24 68.28,24.54 70.79,27.05 71.55,27.05 73.46,28.96 Q11.2 73.38,29.18 73.38,31.39 70.79,33.98 69.72,33.98 D11.A
  Bottom 0.508: v55.93,10.74 56.54,10.74 56.92,11.12 57.61,11.12 58.52,12.04 58.52,12.72 61.34,15.54 61.87,15.54 63.86,17.53 63.86,20.27 v66.14,22.55
LD11  (via drill 0.3)
  Top 0.508: v47.17,5.33 43.28,9.22 43.28,9.98 41.91,11.35 41.91,12.27 SV2.23 | D12.A 80.7,33.98 80.7,32.77 84.43,29.03 Q12.2
  Bottom 0.508: v47.17,5.33 69.04,5.33 73.53,9.83 73.53,15.32 75.21,16.99 80.85,16.99 81.31,16.54 87.02,16.54 88.24,17.75 88.24,24.16 84.51,27.89 84.51,28.96 Q12.2
LD12
  Bottom 0.508: SV2.25 39.4,12.34 40.31,12.34 45.03,17.07 49.53,17.07 51.44,18.97 Q13.2 51.36,19.2 51.36,19.81 47.7,23.47 47.7,25.98 D13.A
LD13
  Top 0.508: D14.A 58.75,24 61.19,24 62.48,22.71 62.48,19.05 Q14.2
  Bottom 0.508: SV2.27 37.72,12.27 38.86,11.12 55.02,11.12 55.93,12.04 55.93,12.72 59.44,16.23 61.57,16.23 62.48,17.14 62.48,18.97 Q14.2
LD14  (via drill 0.3)
  Top 0.508: v72.31,21.34 72.31,20.19 73.46,19.05 Q15.2
  Bottom 0.508: SV2.29 34.29,12.27 35.2,12.27 36.58,10.9 37.26,10.9 38.18,9.98 38.18,9.3 40.69,6.78 68.5,6.78 72.16,10.44 72.16,17.68 73.46,18.97 Q15.2 | v72.31,21.34 69.72,23.93 D15.A
LD15
  Bottom 0.508: 78.87,23.62 78.94,23.7 78.94,24.38 80.62,26.06 D16.A | 78.87,23.62 77.88,22.63 77.19,22.63 74.83,20.27 74.83,17.91 72.85,15.93 72.85,10.13 68.81,6.1 38.79,6.1 35.66,9.22 35.66,9.98 34.75,10.9 33.98,10.9 32.61,12.27 31.77,12.27 SV2.31 | 78.87,23.62 79.55,22.94 80.54,22.94 84.43,19.05 Q16.2
LED0
  Bottom 0.152: R4.2 29.03,28.57 29.03,30.02 34.37,35.36 34.37,45.57 34.9,46.1 34.9,78.49 30.63,82.75 30.63,84.58 29.41,85.8 MC1.P$34
LED0A
  Bottom 0.152: LD1.AR 21.11,4.04 21.11,10.29 29.95,19.13 29.95,22.48 29.03,23.39 R4.1
LED1  (via drill 0.3)
  Top 0.152: v34.37,73 44.58,83.21 MC1.P$2
  Bottom 0.152: v34.37,73 34.59,72.77 34.59,46.25 34.06,45.72 34.06,35.51 28.04,29.49 28.04,23.09 28.96,22.17 28.96,20.57 R5.2
LED1A
  Top 0.152: LD1.AX 16,4.04 16,7.85 21.57,13.41 26.98,13.41 28.96,15.39 R5.1
MIDIINSND
  Top 0.152: 72.96,62.98 74.45,61.49 R6.1 | 72.96,62.98 72.31,63.63 56.92,63.63 53.49,60.2 53.26,60.2 OK1.1 | 72.96,62.98 76.96,66.98 76.96,67.74 D0.C
MIRTN  (via drill 0.3)
  Top 0.152: 64.92,61.11 73.53,61.11 74.45,60.2 76.96,60.2 D0.A | 64.92,61.11 57.91,61.11 57,60.2 55.78,60.2 OK1.2 | 64.92,61.11 v64.92,62.03
  Bottom 0.152: v64.92,62.03 64.92,73.3 63.25,74.98 62.03,74.98 J7.5
MISND
  Top 0.152: R6.2 74.45,66.6 71.93,69.11 65.3,69.11 62.26,72.16 54.86,72.16 52.05,74.98 J7.4
PWM00  (via drill 0.3)
  Top 0.152: v66.29,75.13 66.14,75.13 65.15,76.12 62.87,76.12 61.99,77 | 61.99,77 55.93,83.06 49.07,83.06 45.11,87.02 44.12,87.02 38.94,81.84 38.94,81.15 32.16,74.37 23.24,74.37 21.34,72.47 21.34,72.31 16.69,67.67 7.62,67.67 X2.PWM00 | v56.69,71.02 v56.69,66.14 | v60.35,74.68 60.35,75.36 61.99,77
  Bottom 0.152: v66.29,75.13 68.43,75.13 RN1.2 | v56.69,66.14 52.27,61.72 52.27,60.27 46.48,54.48 46.48,53.42 48.92,50.98 48.92,49.07 Q1.1 | v60.35,74.68 v56.69,71.02
PWM01  (via drill 0.3)
  Top 0.152: v61.49,56.62 61.49,50.67 59.89,49.07 Q2.1 | RN1.3 68.43,72.54 65.3,72.54 v64.39,71.63 64.39,71.7 64.24,71.7 63.17,72.77 59.74,72.77 50.52,81.99 44.12,81.99 33.98,71.86 28.96,71.86 22.25,65.15 7.62,65.15 X2.PWM01
  Bottom 0.152: v64.39,71.63 64.39,66.98 61.72,64.31 61.72,56.84 v61.49,56.62
PWM02
  Top 0.152: Q3.1 71.02,49.07 71.02,52.35 75.67,57 75.97,57 78.49,59.51 78.49,68.5 76.05,70.94 70.41,70.94 69.57,70.1 68.5,70.1 RN1.4 68.43,70.03 67.82,69.42 65.84,69.42 62.79,72.47 59.59,72.47 52.65,79.4 44.12,79.4 34.06,69.34 28.96,69.34 22.17,62.56 7.62,62.56 X2.PWM02
PWM03  (via drill 0.3)
  Top 0.152: v79.48,60.35 79.48,51.51 81.92,49.07 Q4.1 | v24.77,60.05 27.28,60.05 28.96,61.72 v39.09,61.72
  Bottom 0.152: v79.48,60.35 78.11,61.72 77.57,61.72 73.08,66.22 73.08,67.89 72.54,68.43 70.48,68.43 69.57,67.51 68.5,67.51 RN1.5 68.5,67.59 66.9,69.19 66.9,70.18 65.3,71.78 65.3,73.69 62.56,76.43 59.21,76.43 50.9,68.12 48.62,68.12 47.32,66.83 44.2,66.83 v39.09,61.72 | v24.77,60.05 7.62,60.05 X2.PWM03
PWM04  (via drill 0.3)
  Top 0.152: v59.36,64.47 59.51,64.31 64.31,64.31 64.92,64.92 68.43,64.92 RN1.6 | v22.02,40.46 7.62,54.86 X2.PWM04 | v30.63,36.58 30.63,35.28 35.2,30.71 40.69,30.71 48.92,38.94 Q5.1
  Bottom 0.152: v59.36,64.47 59.36,62.56 56.69,59.89 56.69,57.76 52.5,53.57 52.5,42.52 49,39.01 Q5.1 | v22.02,40.46 26.52,40.46 29.34,37.64 29.57,37.64 v30.63,36.58
PWM05  (via drill 0.3)
  Top 0.152: v28.65,43.2 28.65,40.92 31.77,37.8 31.77,34.59 35.36,31.01 38.63,31.01 46.48,38.86 46.48,44.5 47.17,45.19 52.43,45.19 58.6,39.01 59.89,39.01 Q6.1
  Bottom 0.152: RN1.7 68.43,62.41 68.43,62.26 64.31,58.14 64.31,50.44 63.78,49.91 63.78,42.9 59.89,39.01 Q6.1 | v28.65,43.2 10.29,43.2 6.55,46.94 6.55,50.22 7.54,51.21 7.54,52.35 X2.PWM05
PWM06  (via drill 0.3)
  Top 0.152: v67.97,54.03 67.97,41.99 70.94,39.01 Q7.1 | v32.08,64.01 33.22,64.01 43.59,74.37 49.23,74.37 54.1,69.49 54.1,65.53 53.87,65.3 53.87,64.85 54.79,63.93 v72.77,63.93
  Bottom 0.152: v67.97,54.03 66.9,55.09 66.9,57.68 68.43,59.21 68.43,59.82 RN1.8 68.5,59.89 69.42,60.81 71.86,60.81 73.08,62.03 73.08,62.79 72.77,63.09 v72.77,63.93 | v32.08,64.01 31.55,63.48 31.55,50.67 29.87,49 28.88,49 28.04,49.84 7.62,49.84 X2.PWM06
PWM07  (via drill 0.3)
  Top 0.152: v88.01,52.35 88.01,51.97 88.77,51.21 88.77,46.18 81.99,39.4 81.99,39.01 Q8.1 | v42.37,54.79 v34.06,46.48 | v47.24,57.23 47.78,57.76 v51.66,57.76 | v55.24,57.76 62.41,57.76 62.56,57.91 67.89,57.91 68.43,57.38 RN1.9
  Bottom 0.152: v88.01,52.35 86.26,52.35 83.44,55.17 76.43,55.17 73.3,58.29 70.48,58.29 69.57,57.38 68.5,57.38 RN1.9 | v34.06,46.48 28.88,46.48 28.12,47.24 7.62,47.24 X2.PWM07 | v42.37,54.79 44.2,56.62 46.63,56.62 v47.24,57.23 | v55.24,57.76 v51.66,57.76
PWM08  (via drill 0.3)
  Top 0.152: v63.55,73.15 v65.46,75.06 | v59.89,56.62 59.89,51.13 58.06,49.3 58.06,45.03 57.45,44.42 57.45,43.51 60.2,40.77 60.43,40.77 60.96,40.23 60.96,37.8 60.35,37.19 58.06,37.19 54.48,40.77 53.57,40.77 52.5,39.7 52.5,37.8 49.91,35.2 47.17,35.2 46.48,34.52 46.48,31.47 48.92,29.03 Q9.1 | v46.18,23.55 43.51,20.88 35.36,20.88 30.79,25.45 7.7,25.45 6.55,26.59 6.55,37.49 7.54,38.48 7.54,39.62 X2.PWM08
  Bottom 0.152: v65.46,75.06 66.45,76.05 69.49,76.05 70.41,75.13 71.48,75.13 RN2.2 | v63.55,73.15 59.89,69.49 v59.89,56.62 | v46.18,23.55 46.18,26.67 48.46,28.96 48.92,28.96 Q9.1
PWM09  (via drill 0.3)
  Top 0.152: v66.37,69.95 67.36,70.94 68.81,70.94 70.41,72.54 71.48,72.54 RN2.3 | v62.94,57.07 62.94,56.08 62.79,55.93 62.79,50.9 63.55,50.14 63.55,46.33 62.71,45.49 62.71,41.3 v63.55,40.46 | v18.75,25.98 32.31,25.98 35.36,22.94 41.3,22.94 v41.38,22.86
  Bottom 0.152: v66.37,69.95 66.37,66.98 65.46,66.06 65.46,61.8 62.94,59.28 v62.94,57.07 | v63.55,40.46 63.55,35.74 59.97,32.16 59.97,31.93 | 59.97,31.93 59.97,29.03 Q10.1 | v18.75,25.98 7.62,37.11 X2.PWM09 | v41.38,22.86 41.38,23.16 44.88,26.67 44.88,27.13 49.68,31.93 59.97,31.93
PWM10  (via drill 0.3)
  Top 0.152: 70.07,51.85 69.95,51.74 69.95,45.41 72.01,43.36 v72.01,41.53 | 70.07,51.85 75.51,57.3 75.82,57.3 78.18,59.66 78.18,68.35 76.5,70.03 71.55,70.03 RN2.4 | v71.32,32.38 71.32,29.34 71.02,29.03 Q11.1 | v43.13,53.03 v33.53,43.43 | v48.01,57.23 62.33,57.23 62.71,57.61 65.15,57.61 68.5,54.25 68.5,53.42 70.07,51.85
  Bottom 0.152: v72.01,41.53 72.01,33.07 v71.32,32.38 | v33.53,43.43 32.77,42.67 23.47,42.67 19.43,38.63 7.7,38.63 6.55,37.49 6.55,36.8 7.54,35.81 7.54,34.67 X2.PWM10 | v43.13,53.03 44.2,54.1 45.11,54.1 48.01,57 v48.01,57.23
PWM11  (via drill 0.3)
  Top 0.152: v66.67,66.52 61.65,71.55 53.03,71.55 47.7,76.89 44.12,76.89 34.06,66.83 28.96,66.83 23.93,61.8 23.93,41.6 14.4,32.08 7.62,32.08 X2.PWM11
  Bottom 0.152: Q12.1 81.99,29.03 81.99,29.34 89.76,37.11 89.76,54.25 88.85,55.17 83.9,55.17 77.65,61.42 77.42,61.42 71.55,67.28 71.55,67.44 RN2.5 71.55,67.21 70.87,66.52 v66.67,66.52
PWM12  (via drill 0.3)
  Top 0.152: v62.26,56.62 62.26,50.98 60.96,49.68 v60.96,42.22 | v51.21,31.01 v51.21,32.46 | v46.94,23.62 46.48,24.08 45.95,24.08 45.26,23.39 35.36,23.39 31.77,26.98 7.62,26.98 X2.PWM12
  Bottom 0.152: v62.26,56.62 62.33,56.54 63.17,56.54 63.48,56.84 63.48,59.36 67.44,63.32 68.81,63.32 70.41,64.92 71.48,64.92 RN2.6 | v60.96,42.22 56.54,37.8 56.54,33.53 55.47,32.46 v51.21,32.46 | v51.21,31.01 49.99,29.79 49.99,27.81 49.38,27.2 47.17,27.2 46.48,26.52 46.48,24 46.9,23.58 | 46.9,23.58 48.92,21.57 48.92,19.05 Q13.1 | v46.94,23.62 46.9,23.58
PWM13  (via drill 0.3)
  Top 0.152: v61.49,31.09 v61.49,34.44 | v60.88,23.24 60.88,19.96 59.97,19.05 Q14.1 59.97,18.97 60.66,18.29 60.66,11.89 60.05,11.28 59.82,11.28 58.67,10.13 58.67,9.91 56.24,7.47 47.85,7.47 45.95,9.37 45.95,9.6 44.81,10.74 44.58,10.74 43.43,11.89 43.43,12.12 v41.22,14.33 | v38.63,16.92 31.32,16.92 23.85,24.38 7.62,24.38 X2.PWM13
  Bottom 0.152: v61.49,34.44 61.49,40.16 64.08,42.75 64.08,43.43 66.06,45.41 66.06,50.14 65.08,51.13 65.08,58.45 67.44,60.81 68.81,60.81 70.41,62.41 71.48,62.41 RN2.7 | v61.49,31.09 61.49,23.85 v60.88,23.24 | v41.22,14.33 v38.63,16.92
PWM14  (via drill 0.3)
  Top 0.152: v75.89,56.46 75.89,51.05 74.98,50.14 v74.98,42.29 | v18.59,9.68 26.21,9.68 28.35,7.54 v43.89,7.54
  Bottom 0.152: v75.89,56.46 72.54,59.82 71.55,59.82 RN2.8 | v74.98,42.29 77.04,40.23 77.04,35.43 76.12,34.52 76.12,31.09 77.04,30.18 77.04,25.45 72.85,21.26 72.85,20.88 71.02,19.05 Q15.1 70.94,18.97 70.94,12.04 70.18,11.28 70.03,11.28 68.81,10.06 68.81,9.91 66.45,7.54 v43.89,7.54 | v18.59,9.68 18.59,13.95 15.7,16.84 8.69,16.84 6.55,18.97 6.55,19.74 7.54,20.73 7.54,21.87 X2.PWM14
PWM15  (via drill 0.3)
  Top 0.152: v74.52,54.33 74.52,42.6 74.45,42.52 74.45,40.23 74.52,40.16 74.52,34.75 74.3,34.52 74.3,30.4 74.98,29.72 74.98,27.89 77.65,25.22 77.8,25.22 79.1,23.93 79.1,21.87 80.12,20.84 | 80.12,20.84 81.92,19.05 Q16.1 | v19.58,9.14 26.29,9.14 30.63,4.8 66.29,4.8 73.69,12.19 73.69,15.16 75.74,17.22 76.5,17.22 80.12,20.84
  Bottom 0.152: v74.52,54.33 71.55,57.3 RN2.9 | v19.58,9.14 19.58,9.45 18.97,10.06 18.97,14.02 13.64,19.36 7.62,19.36 X2.PWM15
RST
  Top 0.152: MC1.P$13 29.41,55.32 44.58,55.32 MC1.P$22
RX
  Bottom 0.152: OK1.7 55.7,67.74 55.7,65.61 49.07,58.98 RN3.5 49,58.9 49,57.45 44.65,53.11 44.65,52.81 MC1.P$14 44.58,52.73 43.05,51.21 43.05,27.81 38.33,23.09 38.33,21.95 SV3.3
SCL  (via drill 0.3)
  Top 0.152: v38.79,68.81 44.58,63.02 MC1.P$10 | 66.9,81.53 57.91,81.53 56.08,83.36 49.23,83.36 45.26,87.33 39.85,87.33 36.92,84.39 | 66.9,81.53 69.95,81.53 JG1.1 | 36.92,84.39 34.06,81.53 JG2.1 | v36.88,84.43 36.92,84.39 | v82.68,66.67 84.96,68.96 J1.3 | v81,66.14 80.77,66.14 78.79,68.12 78.79,68.66 73.23,74.22 67.44,74.22 66.9,74.75 66.9,81.53
  Bottom 0.152: v38.79,68.81 38.79,75.06 34.06,79.78 34.06,81.46 JG2.1 | RN3.3 49,63.93 45.57,63.93 44.65,63.02 MC1.P$10 44.58,62.94 40.31,58.67 40.31,32.69 38.33,30.71 38.33,29.57 SV3.9 | v36.88,84.43 32.77,88.54 25.6,88.54 19.74,82.68 19.74,77.27 15.24,72.77 X2.LSCL | v82.68,66.67 81.53,66.67 v81,66.14
SDA  (via drill 0.3)
  Top 0.152: v20.27,78.87 20.27,78.03 16.76,74.52 16.76,72.85 15.62,71.7 14.78,71.7 13.79,72.69 12.72,72.69 X2.LSDA | v81.69,67.67 84.96,70.94 J1.2 | v75.67,66.45 74.83,65.61 72.77,65.61 71.78,66.6 67.36,66.6 62.1,71.86 53.19,71.86 48.31,76.73 v48.31,78.87 | v39.32,67.51 39.32,66.52 44.58,61.27 44.58,60.43 MC1.P$11
  Bottom 0.152: RN3.2 49.07,66.52 49.07,65.91 50.6,64.39 50.6,63.63 49.38,62.41 46.63,62.41 44.65,60.43 MC1.P$11 44.58,60.35 40.62,56.39 40.62,30.48 38.33,28.19 38.33,27.05 SV3.7 | 40.92,80.54 42.67,80.54 44.2,82.07 48.31,82.07 | 40.92,80.54 39.32,80.54 | 39.32,80.54 37.64,80.54 36.73,81.46 36.04,81.46 JG2.2 | 48.31,82.07 53.11,82.07 55.78,84.73 68.73,84.73 71.93,81.53 JG1.2 | v20.27,78.87 20.27,81.23 20.04,81.46 20.04,82.53 25.76,88.24 32.31,88.24 37.49,83.06 39.7,83.06 40.92,81.84 40.92,80.54 | v81.69,67.67 81.46,67.44 81.46,67.36 80.54,66.45 v75.67,66.45 | 48.31,82.07 v48.31,78.87 | 39.32,80.54 v39.32,67.51
THS  (via drill 0.3)
  Top 0.152: v46.41,64.47 49,61.87 49,61.49 RN3.4 | v41.6,63.48 31.39,63.48 29.41,65.46 MC1.P$26 29.34,65.46 24.23,60.35 24.23,37.72 28.57,33.38 28.65,33.38 29.95,32.08 29.95,31.32 35.66,25.6 35.66,24.46 SV3.6 | v64.39,73.08 v65.84,73.08
  Bottom 0.152: v46.41,64.47 45.34,64.47 45.03,64.16 42.29,64.16 v41.6,63.48 | v65.84,73.08 67.28,71.63 71.86,71.63 73.38,70.1 73.38,66.37 74.14,65.61 77.04,65.61 83.59,59.05 84.43,59.05 U1.2 | v64.39,73.08 63.78,73.69 62.64,73.69 58.98,70.03 55.32,70.03 54.1,68.81 54.1,66.52 49.07,61.49 RN3.4
TX
  Bottom 0.152: SV3.1 38.33,19.43 38.33,20.57 43.36,25.6 43.36,49 44.58,50.22 MC1.P$15
VCC  (via drill 0.3)
  Top 0.508: v33.15,35.81 36.2,35.81 37.34,34.67 38.25,34.67 SV3.13 | MC1.P$23 29.34,57.84 29.34,57.3 27.43,55.4 27.43,38.33 28.96,36.8 C9.1 | RN3.1 49.07,69.04 51.97,69.04 OK1.8 53.11,67.59 52.12,66.6 52.12,58.37 52.73,57.76 53.65,57.76 54.33,58.45 54.33,60.35 56.69,62.71 63.93,62.71 C6.1 | J1.5 84.96,65.08 83.21,65.08 80.7,67.59 C7.1 80.47,67.74 73.53,74.68 73.53,77.11 73.99,77.57 73.99,81.46 JG1.3 73.84,81.69 71.63,83.9 v56.24,83.9 56.01,83.97 53.03,83.97 49.15,87.86 38.41,87.86 32.92,82.37 32.92,80.7 33.22,80.39 36.42,80.39 37.49,81.46 37.95,81.46 JG2.3 | v74.83,27.2 69.72,22.1 69.72,18.52 66.75,15.54 66.75,15.01 JP1.1 | v74.83,32.77 74.83,34.37 88.24,47.78 88.24,51.05 86.94,52.35 86.94,58.9 87.02,58.98 U1.3
  Bottom 0.508: 30.1,35.66 30.1,33.83 29.03,32.77 29.03,31.77 C8.1 | 30.1,35.66 29.03,36.73 C9.1 | v33.15,35.81 30.25,35.81 30.1,35.66 | 22.78,79.02 21.34,77.57 20.8,77.57 16.46,73.23 16.46,72.24 15.7,71.48 11.43,71.48 10.21,72.69 X2.LVCC | 22.78,79.02 25.15,81.38 25.15,83.59 28.8,87.25 31.77,87.25 37.49,81.53 37.95,81.53 JG2.3 | 22.78,79.02 26.9,74.91 26.9,60.96 29.34,58.52 29.34,57.91 MC1.P$23 | v56.24,83.9 56.24,81.84 49.07,74.68 49.07,69.11 RN3.1 | v74.83,32.77 v74.83,27.2 | J1.5 85.04,65 85.04,61.04 87.02,59.05 U1.3
VIN  (via drill 0.3)
  Top 1.016: D13.C 55.32,26.06 55.32,27.43 55.47,27.58 55.47,33.83 55.32,33.98 D9.C | D1.C 55.32,53.95 55.32,50.52 57.3,48.54 57.3,46.02 55.32,44.04 D5.C | D14.C 66.37,24 66.37,27.51 66.52,27.66 66.52,33.83 66.37,33.98 D10.C 66.14,34.44 66.14,36.73 66.52,37.11 66.52,40.31 66.37,40.46 66.37,43.97 D6.C 66.52,44.42 66.52,50.29 66.37,50.44 66.37,53.95 D2.C 65.84,54.18 64.39,55.63 v63.55,55.63 | D16.C 88.32,26.06 88.32,27.43 88.47,27.58 88.47,33.83 88.32,33.98 D12.C 88.47,34.44 88.47,40.39 88.32,40.54 88.32,43.97 D8.C | D3.C 77.34,53.95 77.34,50.52 77.5,50.37 77.5,44.2 77.34,44.04 D7.C | SV2.2 69.8,9.75 67.82,9.75 SV2.4 67.21,9.75 64.77,9.75 SV2.6 64.24,9.75 62.26,9.75 SV2.8 | SV2.24 41.83,9.75 39.78,9.75 SV2.26 39.32,9.75 37.34,9.75 SV2.28 36.73,9.75 34.75,9.75 SV2.30 34.21,9.75 31.77,9.75 SV2.32 31.24,9.6 31.01,9.6 29.72,8.31 28.65,8.31 27.74,9.22 27.74,12.8 29.03,14.1 29.57,14.1 30.33,14.86 30.33,15.93 | 7.54,16.61 7.54,14.33 X2.RV+ | 7.54,16.61 5.26,18.9 X2.V+15 5.11,19.43 5.11,21.87 X2.V+14 5.11,22.4 5.11,24.38 X2.V+13 5.11,24.92 5.11,26.98 X2.V+12 5.03,27.51 5.03,31.55 X2.V+11 5.11,32.08 5.11,34.59 X2.V+10 5.11,35.13 5.11,37.11 X2.V+09 5.11,37.64 5.11,39.62 X2.V+08 5.03,40.16 5.03,46.79 X2.V+07 5.11,47.32 5.11,49.84 X2.V+06 5.11,50.37 5.11,52.35 X2.V+05 5.11,52.88 5.11,54.86 X2.V+04 | X2.V+03 5.11,60.05 5.11,62.48 X2.V+02 5.11,63.02 5.11,65.08 X2.V+01 5.11,65.61 5.11,67.59 X2.V+00 5.26,68.12 7.54,70.41 7.54,72.69 X2.LV+ | 30.33,15.93 30.33,16 28.19,18.14 9.3,18.14 8,16.84 7.54,16.61 | v51.28,25.98 46.41,21.11 44.81,21.11 39.62,15.93 30.33,15.93
  Bottom 1.016: D5.C 55.32,43.97 55.32,40.54 55.47,40.39 55.47,34.21 55.32,34.06 D9.C | v63.55,55.63 57.99,55.63 56.39,54.03 55.32,54.03 D1.C | 89,51.36 89,44.73 88.32,44.04 D8.C | 89,51.36 89,52.73 88.32,53.42 88.32,53.95 D4.C | D15.C 77.34,24 77.34,24.69 77.8,25.15 77.8,33.53 77.34,33.98 D11.C 77.72,34.37 77.8,34.44 77.8,40.54 77.34,41 77.34,43.97 D7.C | 79.93,51.36 89,51.36 | 79.93,51.36 77.34,53.95 D3.C | D6.C 66.37,44.04 66.52,44.04 69.27,46.79 76.66,46.79 79.7,49.84 79.7,50.9 79.93,51.36 | SV2.24 41.91,9.75 44.35,9.75 SV2.22 44.96,9.75 46.94,9.75 SV2.20 47.4,9.75 49.45,9.75 SV2.18 49.99,9.75 51.97,9.75 SV2.16 52.58,9.75 54.56,9.75 SV2.14 55.02,9.75 57.07,9.75 SV2.12 57.61,9.75 59.59,9.75 SV2.10 60.2,9.75 62.18,9.75 SV2.8 | 22.55,56.39 28.65,50.29 29.34,50.29 MC1.P$20 | 6.55,56.39 22.55,56.39 | 6.55,56.39 5.11,54.94 X2.V+04 | J0.3 22.55,75.97 25.98,72.54 25.98,59.89 22.86,56.77 22.55,56.39 | X2.V+03 5.11,59.97 5.11,58.06 6.33,56.84 6.55,56.39 | v51.28,25.98 55.24,25.98 D13.C

### Text on the board
bPlace: GND | Vin
tNames: DC12V | SCL | SDA | Vcc | GND | SCL | SDA | Vcc | GND | * | Grove | Grove | MKR | GND | 2-103 | SDA | * | * | SCL | MIDI | 221 | D7 | 103 | Vcc | 472 | * | * | * | * | * | TLP2630 | 103 | * | Arduino Micro | MC1 | 104 | X3 | Vcc | 103 | X2 | D7 | X1 | SCL | X0 | SDA | Test Port II | * | 331 | TH | GND | G1 | RX | G0 | TX | * | 331 | * | Pineapple Xvi 0.0.3-X | DC5V | GND | 4-M2.3 | K | Designed for / Takachi / PF10-4-10 | R | G | *
bNames: Vdd | Grove | Grove | V+ | MKR | Vcc | Holes are design guide for 30mm fan | Vin